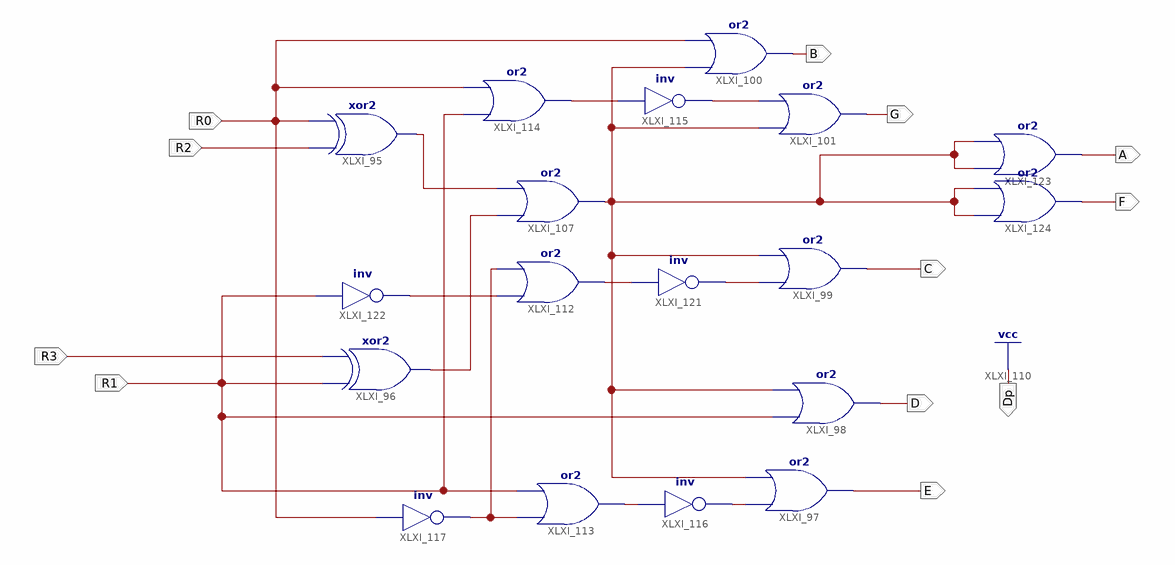
[diagram p0: schematic sheet 1]
// Xilinx ISE schematic ROT_7SEG.sch (spartan6) as structural Verilog: 18 symbols, 12 ports
module ROT_7SEG (
  input  R0,
  input  R2,
  input  R3,
  input  R1,
  output C,
  output D,
  output E,
  output Dp,
  output B,
  output G,
  output F,
  output A
);

  wire n0, n1, XLXN_229, XLXN_270, XLXN_271, XLXN_272, XLXN_273, XLXN_277, XLXN_278, XLXN_300, XLXN_303;

  xor XLXI_95 (n0, R2, R0);
  xor XLXI_96 (n1, R1, R3);
  or XLXI_97 (E, XLXN_272, XLXN_303);
  or XLXI_98 (D, R1, XLXN_303);
  or XLXI_99 (C, XLXN_229, XLXN_303);
  or XLXI_107 (XLXN_303, n1, n0);
  or XLXI_112 (XLXN_278, XLXN_277, XLXN_300);
  or XLXI_113 (XLXN_273, XLXN_300, R1);
  or XLXI_114 (XLXN_271, R1, R0);
  not XLXI_115 (XLXN_270, XLXN_271);
  not XLXI_116 (XLXN_272, XLXN_273);
  not XLXI_117 (XLXN_300, R0);
  or XLXI_100 (B, XLXN_303, R0);
  or XLXI_101 (G, XLXN_303, XLXN_270);
  not XLXI_121 (XLXN_229, XLXN_278);
  not XLXI_122 (XLXN_277, R1);
  or XLXI_123 (A, XLXN_303, XLXN_303);
  or XLXI_124 (F, XLXN_303, XLXN_303);

  assign Dp = 1'b1;
endmodule
